# Altium project MJE13001_SWITCHING_NO_FEEDBACK.PrjPcb
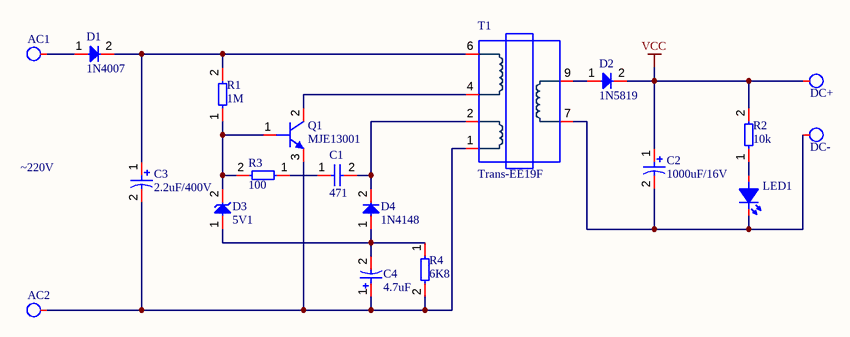
[diagram p0: MJE13001_SWITCHING_NO_FEEDBACK.SchDoc]
1 sheet, 19 parts. Net scope: global (net labels, ports and power ports of the same name join across sheets).
Board files: MJE13001_SWITCHING_NO_FEEDBACK.PcbDoc, PCB1.PcbDoc

## Sheet MJE13001_SWITCHING_NO_FEEDBACK.SchDoc
size A4; SheetNumber: 1; SheetTotal: 1

### Parts
AC1  SolderPoint  [SolderPoint]  (value not drawn)
AC2  SolderPoint  [SolderPoint]  (value not drawn)
C1  471  [CAP_DISC_PITCH_2.54MM]
C2  1000uF/16V  [CAP_RAD_7mm]
C3  2.2uF/400V  [CAP_RAD_7mm]
C4  4.7uF  [CAP_RAD_4mm]
D1  1N4007  [DO-41]
D2  1N5819  [DO-35 Horizontal]
D3  5V1  [DO-35 Horizontal]
D4  1N4148  [DO-35 Horizontal]
DC+  SolderPoint  [SolderPoint]  (value not drawn)
DC-  SolderPoint  [SolderPoint]  (value not drawn)
LED1  LED 5mm  [LED_5MM]  (value not drawn)
Q1  MJE13001  [TO-92]
R1  1M  [RES-0.25W-H-MF]
R2  10k  [R0805]
R3  100  [RES-0.25W-H-MF]
R4  6K8  [RES-0.25W-H-MF]
T1  Trans-EE19F  [TRANS_EE19F]

### Nets
VCC: C2.1 D2.2 DC+.1 R2.2
NetAC1_1: AC1.1 D1.1
NetAC2_1: AC2.1 C3.2 C4.1 Q1.3(E) R4.2 T1.1
NetC1_1: C1.1 R3.1
NetC1_2: C1.2 D4.2 T1.2
NetC2_2: C2.2 DC-.1 LED1.2(K) T1.7
NetC3_1: C3.1 D1.2 R1.2 T1.6
NetC4_2: C4.2 D3.1 D4.1 R4.1
NetD2_1: D2.1 T1.9
NetD3_2: D3.2 Q1.1(B) R1.1 R3.2
NetLED1_1: LED1.1(A) R2.1
NetQ1_2: Q1.2(C) T1.4

### Notes on the sheet
- ~220V

### Library data of the parts
C1 = Capacitors(Disc)
C2-C4 = Capacitor(Radian)
D2 D4 = Diode 1N4148
D3 = Diode Zener
Q1 = MJE13001_Type_F
R1 R3 R4 = Resistors THD
R2 = Resistor SMD